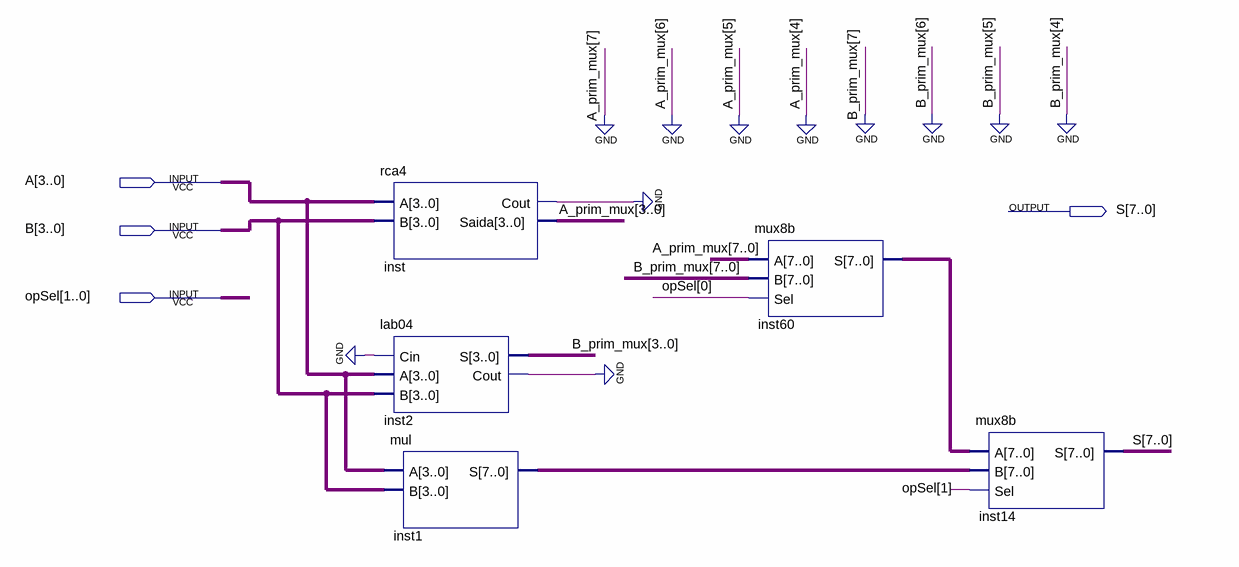
[diagram p0: schematic sheet]
// Quartus schematic ULA.bdf as structural Verilog: 5 symbols, 4 pins
module ULA (
  input  [3:0] A,
  input  [3:0] B,
  input  [1:0] opSel,
  output [7:0] S
);

  wire inst2_cout, inst_cout;
  wire [3:0] A_prim_mux, B_prim_mux;
  wire [7:0] inst1_s, inst60_s;

  rca4 inst (.A(A), .B(B), .Cout(inst_cout), .Saida(A_prim_mux));
  lab04 inst2 (.Cin(1'b0), .A(A), .B(B), .S(B_prim_mux), .Cout(inst2_cout));
  mul inst1 (.A(A), .B(B), .S(inst1_s));
  mux8b inst60 (.A({4'b0000, A_prim_mux}), .B({4'b0000, B_prim_mux}), .Sel(opSel[0]), .S(inst60_s));
  mux8b inst14 (.A(inst60_s), .B(inst1_s), .Sel(opSel[1]), .S(S));
  // also tied to GND on the sheet: {inst2_cout, inst_cout}
endmodule
